# Altium schematic sheet adc.SchDoc
size A3
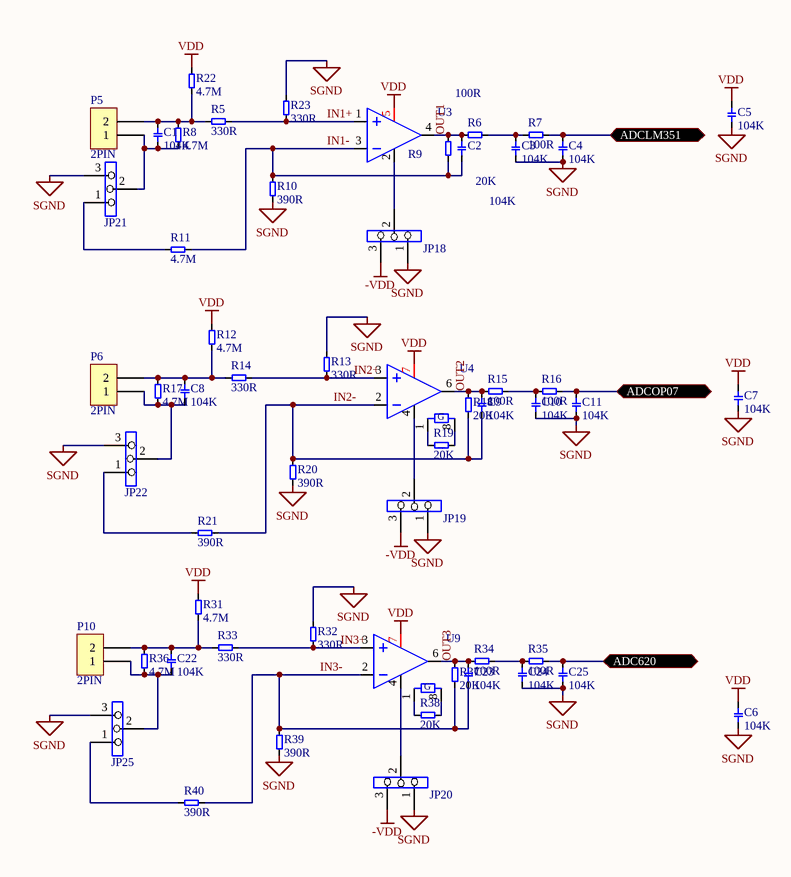
[diagram p0: adc.SchDoc]

## Parts
C1  104K  [0603]
C2  104K  [0603]
C3  104K  [0603]
C4  104K  [0603]
C5  104K  [0603]
C6  104K  [0603]
C7  104K  [0603]
C8  104K  [0603]
C9  104K  [0603]
C10  104K  [0603]
C11  104K  [0603]
C22  104K  [0603]
C23  104K  [0603]
C24  104K  [0603]
C25  104K  [0603]
JP18  Jumper3  [CON3-P2.54]  (value not drawn)
JP19  Jumper3  [CON3-P2.54]  (value not drawn)
JP20  Jumper3  [CON3-P2.54]  (value not drawn)
JP21  Jumper3  [CON3-P2.54]  (value not drawn)
JP22  Jumper3  [CON3-P2.54]  (value not drawn)
JP25  Jumper3  [CON3-P2.54]  (value not drawn)
P5  2PIN  [CON2-P2.54]
P6  2PIN  [CON2-P2.54]
P10  2PIN  [CON2-P2.54]
R5  330R  [0603]
R6  100R  [0603]
R7  100R  [0603]
R8  4.7M  [0603]
R9  20K  [0603]
R10  390R  [0603]
R11  4.7M  [0603]
R12  4.7M  [0603]
R13  330R  [0603]
R14  330R  [0603]
R15  100R  [0603]
R16  100R  [0603]
R17  4.7M  [0603]
R18  20K  [0603]
R19  20K  [0603]
R20  390R  [0603]
R21  390R  [0603]
R22  4.7M  [0603]
R23  330R  [0603]
R31  4.7M  [0603]
R32  330R  [0603]
R33  330R  [0603]
R34  100R  [0603]
R35  100R  [0603]
R36  4.7M  [0603]
R37  20K  [0603]
R38  20K  [0603]
R39  390R  [0603]
R40  390R  [0603]
U3  LM321  [SOT-23-5L]  (value not drawn)
U4  OP07  [SOIC8_39MM]  (value not drawn)
U9  OP07  [SOIC8_39MM]  (value not drawn)

## Ports
ADC620, ADCLM351, ADCOP07

## Nets
-VDD: JP18.3 JP19.3 JP20.3
SGND: C3.1 C4.1 C5.1 C6.1 C7.1 C10.1 C11.1 C24.1 C25.1 JP18.1 JP19.1 JP20.1 JP21.3 JP22.3 JP25.3 R10.2 R13.2 R20.2 R23.2 R32.2 R39.2
VDD: C5.2 C6.2 C7.2 R12.1 R22.1 R31.1 U3.5(V+) U4.7(V+) U9.7(V+)
ADC620: C25.2 R35.1 ; port ADC620
ADCLM351: C4.2 R7.1 ; port ADCLM351
ADCOP07: C11.2 R16.1 ; port ADCOP07
IN1+: R5.2 R23.1 U3.1(IN1+)
IN1-: C2.1 R9.2 R10.1 R11.1 U3.3(IN1-)
IN2+: R13.1 R14.2 U4.3(IN1+)
IN2-: C9.1 R18.2 R20.1 R21.2 U4.2(IN1-)
IN3+: R32.1 R33.2 U9.3(IN1+)
IN3-: C23.1 R37.2 R39.1 R40.2 U9.2(IN1-)
OUT1: C2.2 R6.2 R9.1 U3.4(OUT1)
OUT2: C9.2 R15.2 R18.1 U4.6(OUT1)
OUT3: C23.2 R34.2 R37.1 U9.6(OUT1)
NetC1_1: C1.1 JP21.2 P5.1 R8.2
NetC1_2: C1.2 P5.2 R5.1 R8.1 R22.2
NetC3_2: C3.2 R6.1 R7.2
NetC8_1: C8.1 JP22.2 P6.1 R17.2
NetC8_2: C8.2 P6.2 R12.2 R14.1 R17.1
NetC10_2: C10.2 R15.1 R16.2
NetC22_1: C22.1 JP25.2 P10.1 R36.2
NetC22_2: C22.2 P10.2 R31.2 R33.1 R36.1
NetC24_2: C24.2 R34.1 R35.2
NetJP18_2: JP18.2 U3.2(V-)
NetJP19_2: JP19.2 U4.4(V-)
NetJP20_2: JP20.2 U9.4(V-)
NetJP21_1: JP21.1 R11.2
NetJP22_1: JP22.1 R21.1
NetJP25_1: JP25.1 R40.1
NetR19_1: R19.1 U4.1(RG)
NetR19_2: R19.2 U4.8(RG)
NetR38_1: R38.1 U9.1(RG)
NetR38_2: R38.2 U9.8(RG)

## Notes on the sheet
- (in symbol AD620) G

## Library data of the parts
C1-C11 C22-C25 = Cap: 电容; Specifications: 104K,16V,±10%; Published: 8-Jun-2000; LatestRevisionDate: 17-Jul-2002; LatestRevisionNote: Re-released for DXP Platform.; PackageReference: RAD-0.3; Publisher: Altium Limited; Value: 104K
P5 P6 P10 = Header 2: 连接器; specification: pitch3.96mm VH; LatestRevisionDate: 17-Jul-2002; LatestRevisionNote: Re-released for DXP Platform.; Publisher: Altium Limited; Value: 2PIN
R5-R7 R13-R16 R23 R32-R35 = Res1: 电阻; Specifications: 100R,±1%; Published: 8-Jun-2000; LatestRevisionDate: 17-Jul-2002; LatestRevisionNote: Re-released for DXP Platform.; PackageReference: AXIAL-0.3; Publisher: Altium Limited
  R5 R13 R14 R23 R32 R33: Value: 330R
  R6 R7 R15 R16 R34 R35: Value: 100R
R8 R11 R12 R17 R22 R31 R36 = Res1: 电阻; Specifications: 4.7M,±1%; Published: 8-Jun-2000; LatestRevisionDate: 17-Jul-2002; LatestRevisionNote: Re-released for DXP Platform.; PackageReference: AXIAL-0.3; Publisher: Altium Limited; Value: 4.7M
R9 R18 R19 R37 R38 = Res1: 电阻; Specifications: 20K,±1%; Published: 8-Jun-2000; LatestRevisionDate: 17-Jul-2002; LatestRevisionNote: Re-released for DXP Platform.; PackageReference: AXIAL-0.3; Publisher: Altium Limited; Value: 20K
R10 R20 R21 R39 R40 = Res1: 电阻; Specifications: 1%; Published: 8-Jun-2000; LatestRevisionDate: 17-Jul-2002; LatestRevisionNote: Re-released for DXP Platform.; PackageReference: AXIAL-0.3; Publisher: Altium Limited; Value: 390R
U3 = LM321: 运放; Value: LM321; specifications: LM321
U4 U9 = AD620: 运放; Value: OP07; specifications: OP07